# EAGLE design Honey_v2_a (EAGLE 7.2.0)

## Sheet 1 of 2
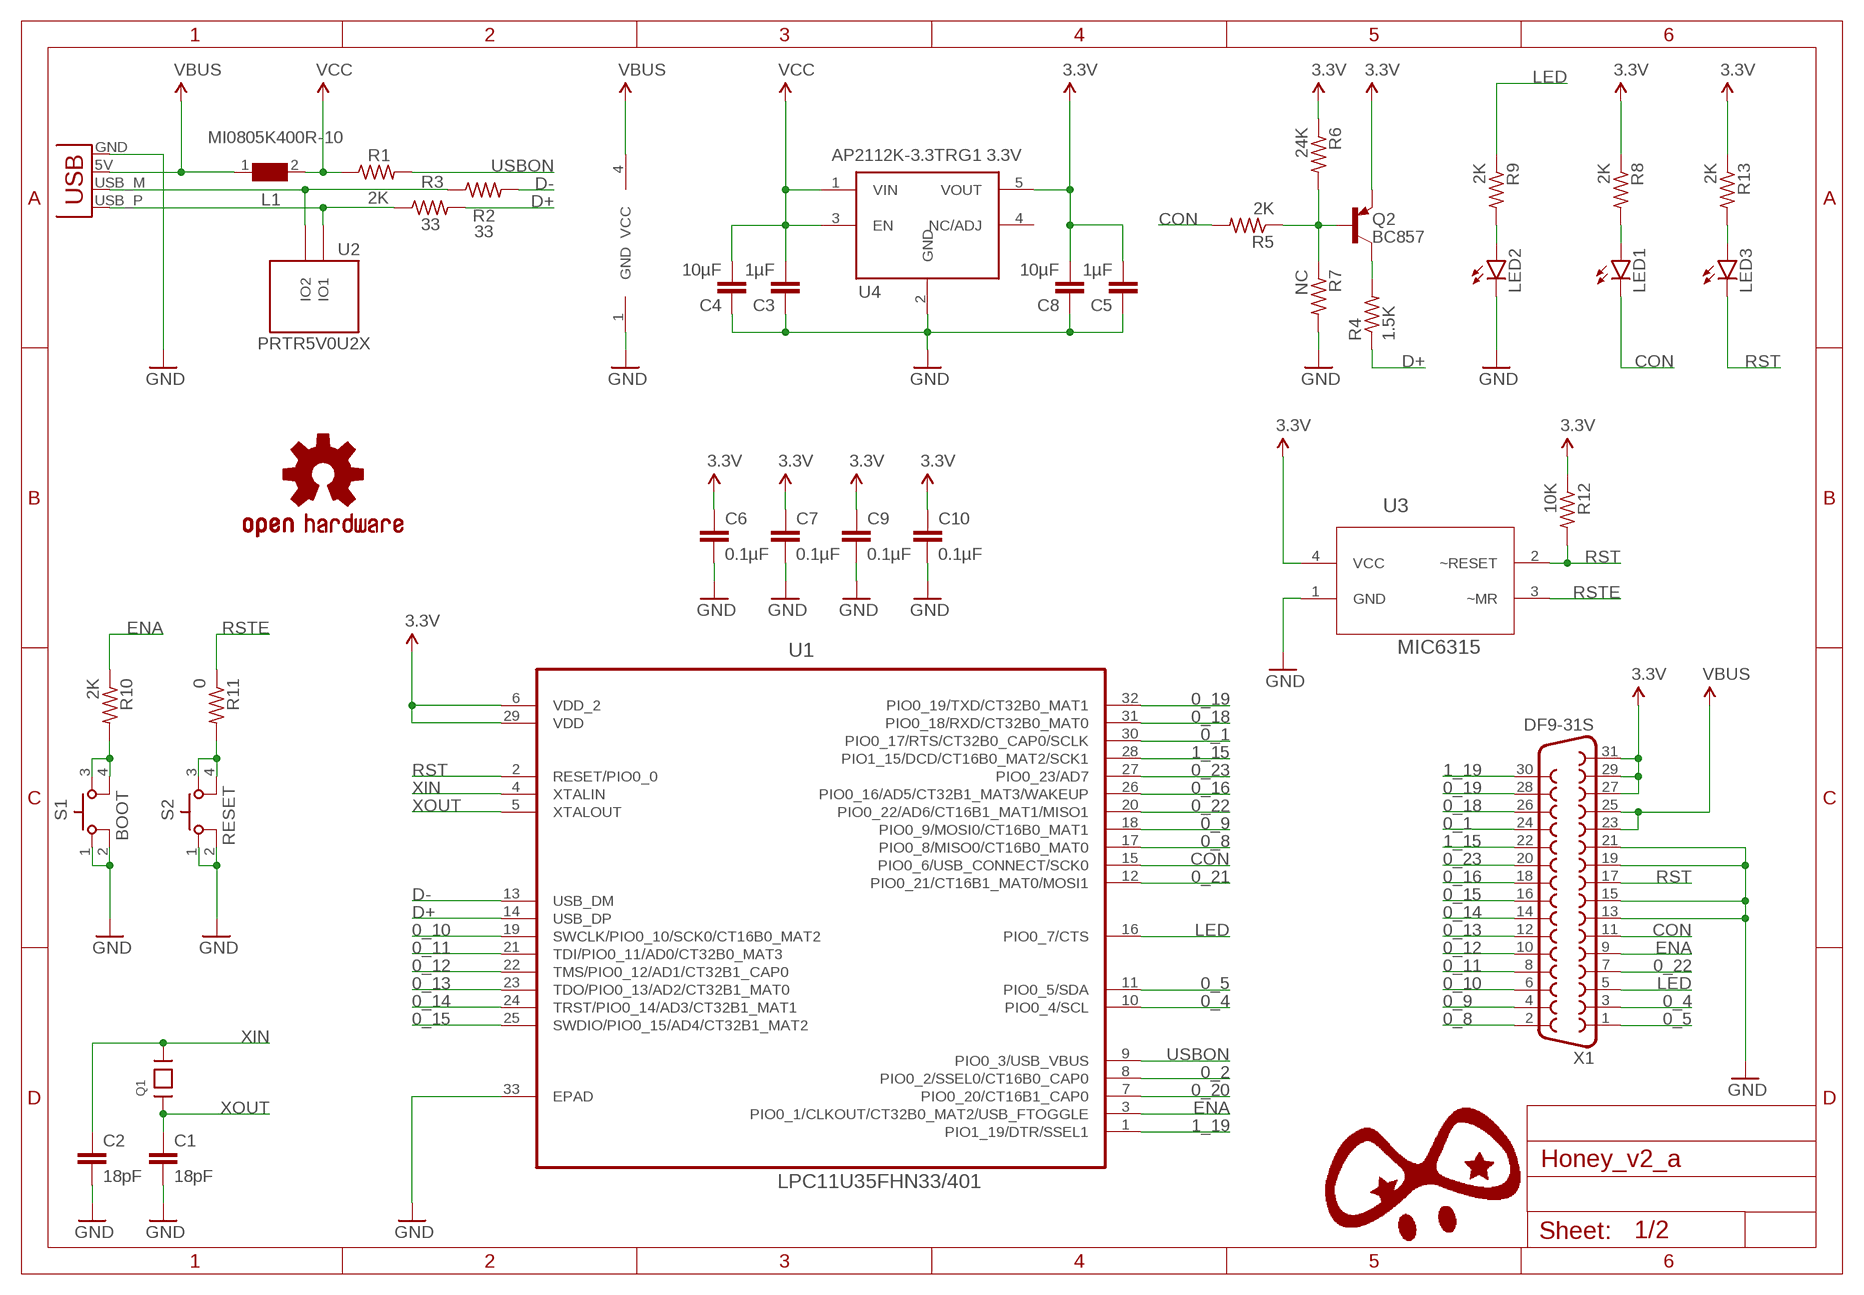
[diagram p0: schematic, sheet 1]

### Parts
C1  18pF  C-EUC0402  [C0402]
C2  18pF  C-EUC0402  [C0402]
C3  1µF  CAP0603-CAP  [0603-CAP]
C4  10µF  CAP0603-CAP  [0603-CAP]
C5  1µF  CAP0603-CAP  [0603-CAP]
C6  0.1µF  C-EUC0402  [C0402]
C7  0.1µF  C-EUC0402  [C0402]
C8  10µF  CAP0603-CAP  [0603-CAP]
C9  0.1µF  C-EUC0402  [C0402]
C10  0.1µF  C-EUC0402  [C0402]
J1  USBPCB  [USB-A-PCB]
L1  MI0805K400R-10  FERRITE-74279201_0805  [0805]
LED1  LED0603  [LED-0603]
LED2  LED0603  [LED-0603]
LED3  LED0603  [LED-0603]
LOGO1  OSHW-LOGOS  [OSHW-LOGO-S]
Q1  12MHz 4 pad crystal 3.2x2.5  CRYSTAL3.2X2.5  [CRYSTAL_3.2X2.5]
Q2  BC857  BC857A-PNP-SOT23-BEC  [SOT23-BEC]
R1  2K  R-US_R0402  [R0402]
R2  33  R-US_R0603  [R0603]
R3  33  R-US_R0603  [R0603]
R4  1.5K  R-US_R0402  [R0402]
R5  2K  R-US_R0402  [R0402]
R6  24K  R-US_R0402  [R0402]
R7  NC  R-US_R0402  [R0402]
R8  2K  R-US_R0402  [R0402]
R9  2K  R-US_R0402  [R0402]
R10  2K  R-US_R0402  [R0402]
R11  0  R-US_R0402  [R0402]
R12  10K  R-US_R0402  [R0402]
R13  2K  R-US_R0402  [R0402]
S1  BOOT  MINI_PUSHBUTTON  [MINI_PUSHBUTTON]
S2  RESET  MINI_PUSHBUTTON  [MINI_PUSHBUTTON]
U1  LPC11U35FHN33/401  [QFN65P700X700X100-33N]
U2  PRTR5V0U2X  [SOT-143B]
U3  MIC6315  [SOT-143B]
U4  AP2112K-3.3TRG1 3.3V  5PIN_REG  [SOT23-5]
X1  DF9-31S  [DF9-31S]

### Nets
0_1: U1.30(PIO0_17/RTS/CT32B0_CAP0/SCLK) X1.24
0_2: U1.8(PIO0_2/SSEL0/CT16B0_CAP0)
0_4: U1.10(PIO0_4/SCL) X1.3
0_5: U1.11(PIO0_5/SDA) X1.1
0_8: U1.17(PIO0_8/MISO0/CT16B0_MAT0) X1.2
0_9: U1.18(PIO0_9/MOSI0/CT16B0_MAT1) X1.4
0_10: U1.19(SWCLK/PIO0_10/SCK0/CT16B0_MAT2) X1.6
0_11: U1.21(TDI/PIO0_11/AD0/CT32B0_MAT3) X1.8
0_12: U1.22(TMS/PIO0_12/AD1/CT32B1_CAP0) X1.10
0_13: U1.23(TDO/PIO0_13/AD2/CT32B1_MAT0) X1.12
0_14: U1.24(TRST/PIO0_14/AD3/CT32B1_MAT1) X1.14
0_15: U1.25(SWDIO/PIO0_15/AD4/CT32B1_MAT2) X1.16
0_16: U1.26(PIO0_16/AD5/CT32B1_MAT3/WAKEUP) X1.18
0_18: U1.31(PIO0_18/RXD/CT32B0_MAT0) X1.26
0_19: U1.32(PIO0_19/TXD/CT32B0_MAT1) X1.28
0_20: U1.7(PIO0_20/CT16B1_CAP0)
0_21: U1.12(PIO0_21/CT16B1_MAT0/MOSI1)
0_22: U1.20(PIO0_22/AD6/CT16B1_MAT1/MISO1) X1.7
0_23: U1.27(PIO0_23/AD7) X1.20
1_15: U1.28(PIO1_15/DCD/CT16B0_MAT2/SCK1) X1.22
1_19: U1.1(PIO1_19/DTR/SSEL1) X1.30
3.3V: C5.2 C6.1 C7.1 C8.2 C9.1 C10.1 Q2.E R6.1 R8.1 R12.1 R13.1 U1.6(VDD_2) U1.29(VDD) U3.4(VCC) U4.5(VOUT) X1.27 X1.29 X1.31 ; also sheet 2
AD+: J1.USB_P(D+) R3.1 U2.2(IO1)
AD-: J1.USB_M(D-) R2.1 U2.3(IO2)
CON: LED1.C R5.2 U1.15(PIO0_6/USB_CONNECT/SCK0) X1.11
D+: R3.2 R4.1 U1.14(USB_DP)
D-: R2.2 U1.13(USB_DM)
ENA: R10.1 U1.3(PIO0_1/CLKOUT/CT32B0_MAT2/USB_FTOGGLE) X1.9
GND: C1.2 C2.2 C3.1 C4.1 C5.1 C6.2 C7.2 C8.1 C9.2 C10.2 J1.GND LED2.C R7.2 S1.1 S1.2 S2.1 S2.2 U1.33(EPAD) U2.1(GND) U3.1(GND) U4.2(GND) X1.13 X1.15 X1.19 X1.21 ; also sheet 2
LED: R9.1 U1.16(PIO0_7/CTS) X1.5
N$1: Q2.C R4.2
N$2: Q2.B R5.1 R6.2 R7.1
N$12: LED2.A R9.2
N$14: R10.2 S1.3 S1.4
N$20: R11.2 S2.3 S2.4
N$22: LED1.A R8.2
N$23: LED3.A R13.2
RST: LED3.C R12.2 U1.2(RESET/PIO0_0) U3.2(~RESET) X1.17
RSTE: R11.1 U3.3(~MR)
USBON: R1.2 U1.9(PIO0_3/USB_VBUS)
VBUS: J1.5V(VBUS) L1.1 U2.4(VCC) X1.23 X1.25 ; also sheet 2
VCC: C3.2 C4.2 L1.2 R1.1 U4.1(VIN) U4.3(EN)
XIN: C2.1 Q1.3 U1.4(XTALIN)
XOUT: C1.1 Q1.1 U1.5(XTALOUT)
Unconnected: U4.4(NC/ADJ)

## Sheet 2 of 2
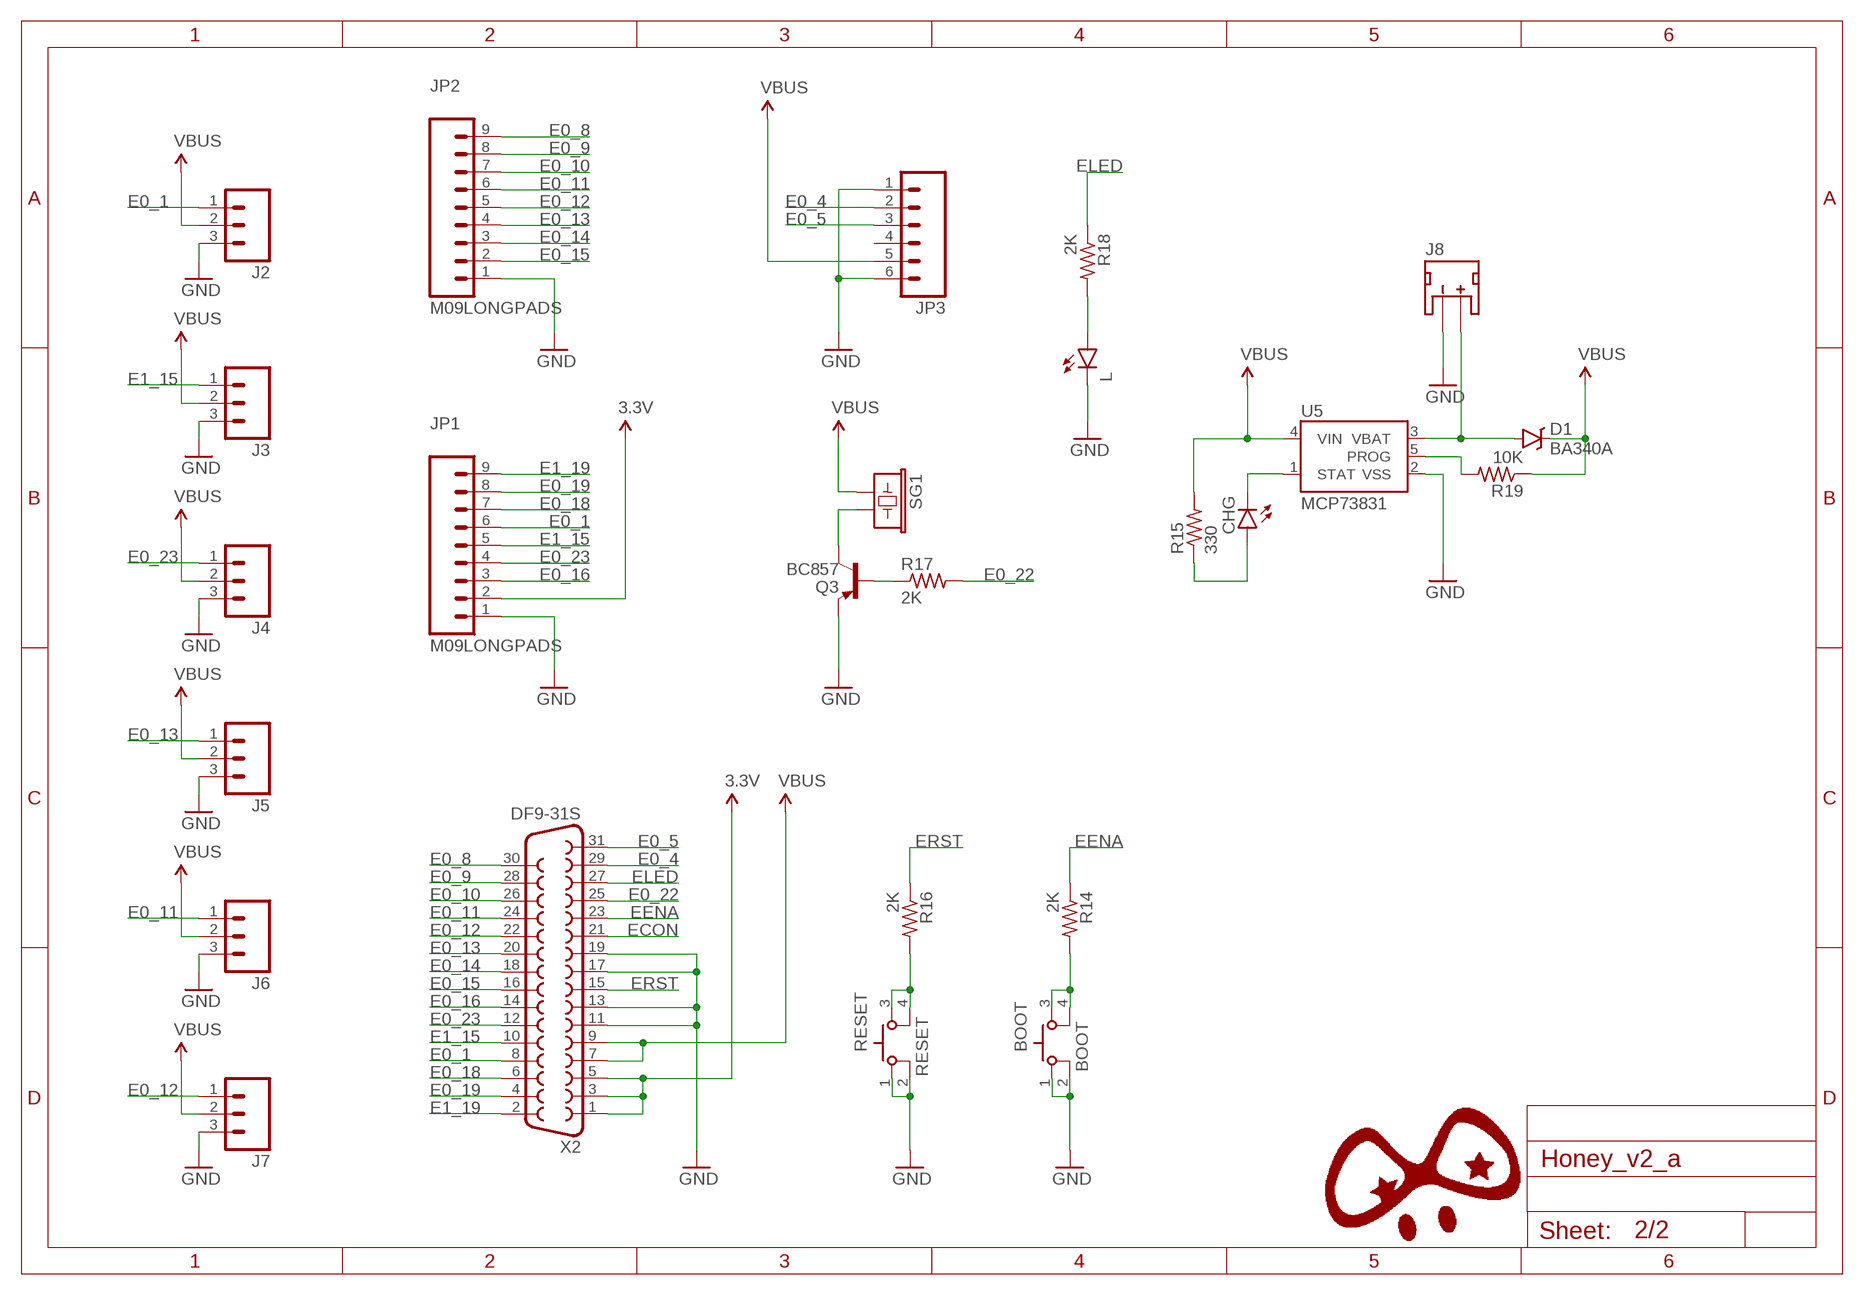
[diagram p1: schematic, sheet 2]

### Parts
BOOT  BOOT  MINI_PUSHBUTTON  [MINI_PUSHBUTTON]
CHG  LED0603  [LED-0603]
D1  BA340A  B340A  [SMA-DIODE]
J2  M03LOCK_NO_SILK  [1X03_LOCK_NO_SILK]
J3  M03LOCK_NO_SILK  [1X03_LOCK_NO_SILK]
J4  M03LOCK_NO_SILK  [1X03_LOCK_NO_SILK]
J5  M03LOCK_NO_SILK  [1X03_LOCK_NO_SILK]
J6  M03LOCK_NO_SILK  [1X03_LOCK_NO_SILK]
J7  M03LOCK_NO_SILK  [1X03_LOCK_NO_SILK]
J8  JST_2MM_MALE  [JST-2-SMD]
JP1  M09LONGPADS  [1X09_LONGPADS]
JP2  M09LONGPADS  [1X09_LONGPADS]
JP3  M06LONGPADS  [1X06_LONGPADS]
L  LED0603  [LED-0603]
Q3  BC857  BC857A-PNP-SOT23-BEC  [SOT23-BEC]
R14  2K  R-US_R0402  [R0402]
R15  330  R-US_R0402  [R0402]
R16  2K  R-US_R0402  [R0402]
R17  2K  R-US_R0402  [R0402]
R18  2K  R-US_R0402  [R0402]
R19  10K  R-US_R0402  [R0402]
RESET  RESET  MINI_PUSHBUTTON  [MINI_PUSHBUTTON]
SG1  BUZZERSMD2  [BUZZER-CCV]
U5  MCP73831  [SOT23-5]
X2  DF9-31S  [DF9-31S]

### Nets
3.3V: JP1.2 X2.1 X2.3 X2.5 ; also sheet 1
E0_1: J2.1 JP1.6 X2.8
E0_4: JP3.2 X2.29
E0_5: JP3.3 X2.31
E0_8: JP2.9 X2.30
E0_9: JP2.8 X2.28
E0_10: JP2.7 X2.26
E0_11: J6.1 JP2.6 X2.24
E0_12: J7.1 JP2.5 X2.22
E0_13: J5.1 JP2.4 X2.20
E0_14: JP2.3 X2.18
E0_15: JP2.2 X2.16
E0_16: JP1.3 X2.14
E0_18: JP1.7 X2.6
E0_19: JP1.8 X2.4
E0_22: R17.2 X2.25
E0_23: J4.1 JP1.4 X2.12
E1_15: J3.1 JP1.5 X2.10
E1_19: JP1.9 X2.2
ECON: X2.21
EENA: R14.1 X2.23
ELED: R18.1 X2.27
ERST: R16.1 X2.15
GND: BOOT.1 BOOT.2 J2.3 J3.3 J4.3 J5.3 J6.3 J7.3 J8.1(-) JP1.1 JP2.1 JP3.1 JP3.6 L.C Q3.E RESET.1 RESET.2 U5.2(VSS) X2.11 X2.13 X2.17 X2.19 ; also sheet 1
N$3: Q3.C SG1.-
N$4: L.A R18.2
N$5: BOOT.3 BOOT.4 R14.2
N$6: R16.2 RESET.3 RESET.4
N$7: Q3.B R17.1
N$8: CHG.C U5.1(STAT)
N$9: CHG.A R15.1
N$10: R19.2 U5.5(PROG)
N$11: D1.A J8.2(+) U5.3(VBAT)
VBUS: D1.C J2.2 J3.2 J4.2 J5.2 J6.2 J7.2 JP3.5 R15.2 R19.1 SG1.+ U5.4(VIN) X2.7 X2.9 ; also sheet 1
Unconnected: J8.NC1(PAD1) J8.NC2(PAD2) JP3.4

## Library data of the parts
BOOT RESET S1 S2 = GHI2:MINI_PUSHBUTTON
C1 C2 C6 C7 C9 C10 = resistor:C-EU: CAPACITOR, European symbol
C3-C5 C8 = SparkFun-Passives:CAP: Capacitor Standard 0603 ceramic capacitor, and 0.1" leaded capacitor.
CHG L LED1-LED3 = SparkFun-LED:LED: LEDs Standard schematic elements and footprints for 5mm, 3mm, 1206, and 0603 sized LEDs. 5mm - Spark Fun Electronics SKU : COM-00529 (and others)
D1 = SparkFun-DiscreteSemi:B340A: Schottky Diode 3A-40V; PROD_ID: DIO-09886
J1 = SparkFun-Connectors:USB: USB Connectors USB-B-PTH is fully proven SKU : PRT-00139/CONN-08278 USB-miniB is fully proven SKU : PRT-00587 USB-A-PCB is untested. USB-A-H is throughly reviewed, but untested. Spark Fun Electronics SKU : PRT-00437 USB-B-SMT is throughly reviewed, but untested. Needs silkscreen touching up. USB-A-S has not been used/tested USB-MB-H has not been used/tested USB-MICROB has been used. CONN-09505
J2-J7 = SparkFun-Connectors:M03: Header 3 Standard 3-pin 0.1" header. Use with straight break away headers (SKU : PRT-00116), right angle break away headers (PRT-00553), swiss pins (PRT-00743), machine pins (PRT-00117), and female headers (PRT-00115). Molex polarized connector foot print use with SKU : PRT-08232 with associated crimp pins and housings.
J8 = SparkFun-Connectors:JST_2MM_MALE: Mates to single-cell LiPo batteries. CONN-08352; PROD_ID: CONN-08352
JP1 JP2 = SparkFun-Connectors:M09: Header 9 Standard 9-pin 0.1" header. Use with straight break away headers (SKU : PRT-00116), right angle break away headers (PRT-00553), swiss pins (PRT-00743), machine pins (PRT-00117), and female headers (PRT-00115).
JP3 = SparkFun-Connectors:M06: Header 6 Standard 6-pin 0.1" header. Use with straight break away headers (SKU : PRT-00116), right angle break away headers (PRT-00553), swiss pins (PRT-00743), machine pins (PRT-00117), and female headers (PRT-00115). Molex polarized connector foot print use with SKU : PRT-08094 with associated crimp pins and housings. NOTES ON THE VARIANTS LOCK and LOCK_LONGPADS... This footprint was designed to help hold the alignment of a through-hole component (i.e. 6-pin header) while soldering it into place. You may notice that each hole has been shifted either up or down by 0.005 of an inch from it's more standard position (which is a perfectly straight line). This slight alteration caused the pins (the squares in the middle) to touch the edges of the holes. Because they are alternating, it causes a "brace" to hold the component in place. 0.005 has proven to be the perfect amount of "off-center" position when using our standard breakaway headers. Although looks a little odd when you look at the bare footprint, once you have a header in there, the alteration is very hard to notice. Also,if you push a header all the way into place, it is covered up entirely on the bottom side. This idea of altering the position of holes to aid alignment will be further integrated into the Sparkfun Library for other footprints. It can help hold any component with 3 or more connection pins.
L1 = Honey_v2:FERRITE: SMD EMI Suppression Ferrite Beads; MPN: 74279201; OC_FARNELL: 1635708; OC_NEWARK: 08P2359; PACKAGE: IND-0805; SUPPLIER: Wuerth Elektronik
LOGO1 = SparkFun-Aesthetics:OSHW-LOGO: Open Source Hardware Logo This logo indicates the piece of hardware it is found on incorporates a OSHW license and/or adheres to the definition of open source hardware found here: http://freedomdefined.org/OSHW
Q1 = GHI:CRYSTAL3.2X2.5
Q2 Q3 = transistor:*-PNP-: PNP Transistror
R1-R19 = resistor:R-US_: RESISTOR, American symbol
SG1 = SparkFun-Electromechanical:BUZZER: Buzzer 12mm Spark Fun Electronics SKU : Comp-Buzzer
U1 = Honey_v2:LPC11U35FHN33/401: MCU, 32BIT, ARM CORTEX-M0, 32HVQFN; MPN: LPC11U35FHN33/401; OC_FARNELL: 2115659; OC_NEWARK: 24W5343; PACKAGE: HVQFN33; SUPPLIER: NXP
U2 = Honey_v2:PRTR5V0U2X?: I2C-Bus EDS Protection Ulta low capacitance double rail-to-rail ESD protection diode Documentation Datasheet <http://www.nxp.com/documents/data_sheet/PRTR5V0U2X.pdf> General Description Ultra low capacitance rail-to-rail ElectroStatic Discharge (ESD) protection diode in a small SOT143B Surface-Mounted Device (SMD) plastic package designed to protect two Hi-Speed data lines or high-frequency signal lines from the damage caused by ESD and other transients. PRTR5V0U2X incorporates two pairs of ultra low capacitance rail-to-rail diodes as well as an additional ESD protection diode to ensure signal line protection even if no supply voltage is available. Features ESD protection of two Hi-Speed data lines or high-frequency signal lines Ultra low input/output to ground capacitance: C(I/O-GND) = 1 pF ESD protection up to 8kV IEC 61000-4-2, level 4 (ESD) Very low clamping voltage due to an integrated additional ESD protection diode Very low reverse current Small SMD plastic package Applications USB 2.0 ports Digital Video Interface (DVI)/High Definition Multimedia Interface (HDMI) interfaces Mobile and cordless phones Personal Digital Assistants (PDA) Digital Cameras Wide Area Network (WAN) / Local Area Network (LAN) systems PCs, notebooks, printers, and other PC peripherals; APPLICATIONS: General Purpose; BIDIRECTIONAL_CHANNELS: 2; CAPACITANCE: 1pF @ 1MHz; CURRENT_PEAK_PULSE: -; DESCRIPTION: TVS DIODE 5.5VWM SOT143B; DOCUMENTATION_LINK: <a href="http://www.nxp.com/documents/data_sheet/PRTR5V0U2X.pdf">Datasheet</a>; DOCUMENTATION_URL: http://www.nxp.com/documents/data_sheet/PRTR5V0U2X.pdf; MANUFACTURER: NXP Semiconductors; MOUNTING_TYPE: Surface Mount; OPERATING_TEMPERATURE: -40C ~ 85C; PART_NUMBER: PRTR5V0U2X,215; POWER-PEAK_PULSE: -; POWER_LINE_PROTECTION: Yes; SUPPLIER_ITEM_LINK: <a href="http://www.digikey.com/product-detail/en/PRTR5V0U2X,215/568-4140-1-ND/1589981">Details</a>; SUPPLIER_ITEM_NUMBER: 568-4140-1-ND; SUPPLIER_ITEM_URL: http://www.digikey.com/product-detail/en/PRTR5V0U2X,215/568-4140-1-ND/1589981; SUPPLIER_LINK: <a href="http://www.digikey.com">Home Page</a>; SUPPLIER_NAME: Digi-Key; SUPPLIER_URL: http://www.digikey.com; TYPE: Steering (Rail to Rail); UNIDIRECTIONAL_CHANNELS: -; VOLTAGE_BREAKDOWN: 6V; VOLTAGE_CLAMPING: -; VOLTAGE_REVERSE: 5.5V
U3 = Honey_v2:MIC6315: MIC6315
U4 = GHI:5PIN_REG
U5 = SparkFun-PowerIC:MCP73831: Miniature single cell, fully integrated Li-Ion, Li-polymer charge management controller http://ww1.microchip.com/downloads/en/DeviceDoc/21984a.pdf IC-09995; PROD_ID: IC-09995
X1 X2 = con-hirose:DF9-31S: SMD CONNECTOR Source: con-hirose.lbr from Bob Starr <rtzaudio@mindspring.com>; MPN: DF9-31S-1V(32); OC_FARNELL: 1798382; OC_NEWARK: 74R3383

## Net classes
0 default: width 0.254 mm, drill 0.254 mm, clearance 0.203 mm

## Board
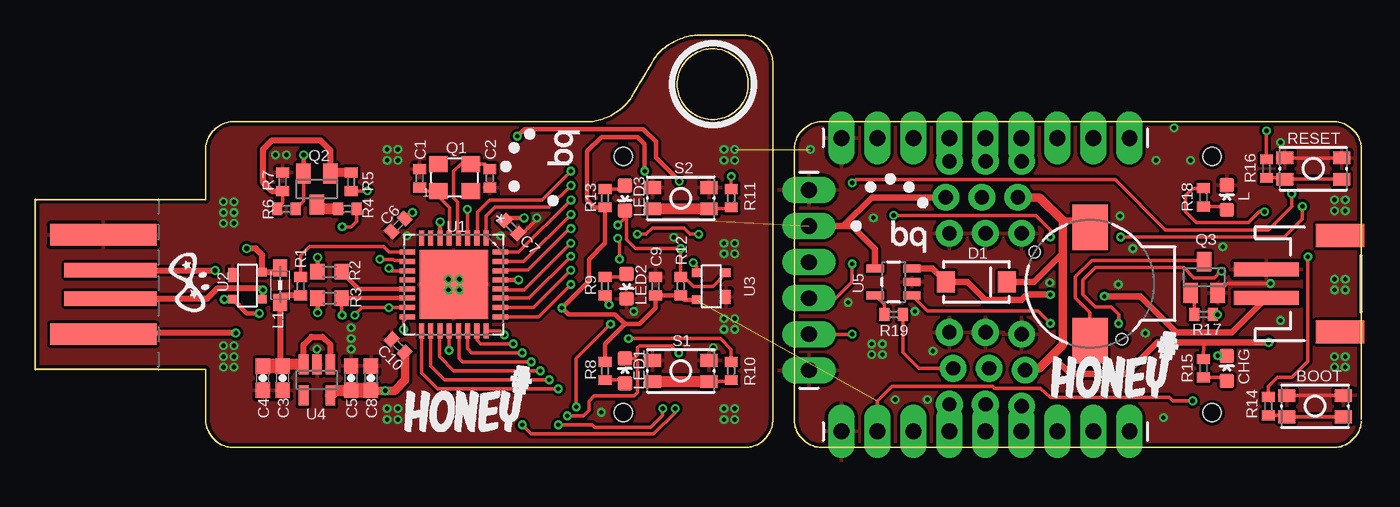
[diagram p2: board, top side]
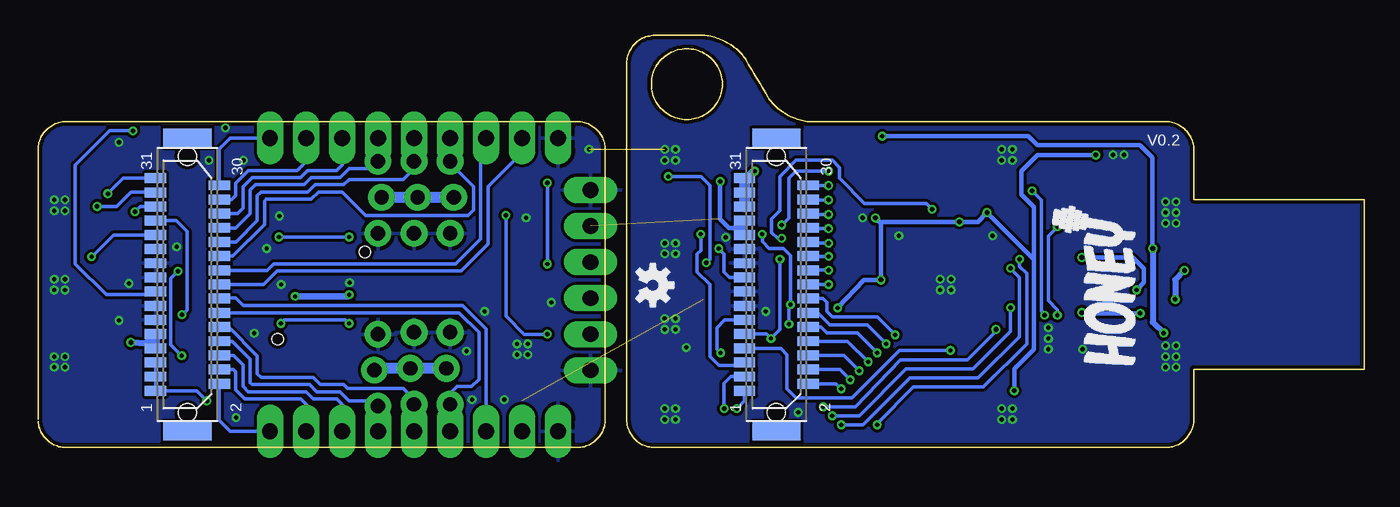
[diagram p3: board, bottom side, seen from below]

Size 93.51 x 29.08 mm. Coordinates in mm from the lower left corner, seen from the top.
Outline: 93.51,1.86 93.49,1.73 93.46,1.6 93.44,1.47 93.4,1.34 93.35,1.22 93.3,1.1 93.23,0.99 93.16,0.88 93.09,0.78 93.01,0.68 92.83,0.5 92.73,0.41 92.62,0.34 92.52,0.27 92.4,0.21 92.16,0.11 92.04,0.07 91.91,0.04 91.78,0.01 91.64,0 55.37,0 55.23,0.01 55.1,0.04 54.97,0.07 54.85,0.11 54.61,0.21 54.5,0.27 54.39,0.34 54.28,0.41 54.18,0.5 54,0.68 53.92,0.78 53.85,0.88 53.78,0.99 53.71,1.1 53.61,1.34 53.57,1.47 53.55,1.6 53.52,1.73 53.51,1.86 53.51,21.14 53.52,21.27 53.55,21.4 53.57,21.53 53.61,21.66 53.66,21.78 53.71,21.9 53.78,22.01 53.85,22.12 53.92,22.22 54,22.32 54.18,22.5 54.28,22.59 54.39,22.66 54.5,22.73 54.61,22.79 54.73,22.84 54.85,22.89 54.97,22.93 55.1,22.96 55.23,22.99 55.37,23 91.64,23 91.78,22.99 91.91,22.96 92.04,22.93 92.16,22.89 92.28,22.84 92.4,22.79 92.52,22.73 92.62,22.66 92.73,22.59 92.83,22.5 93.01,22.32 93.09,22.22 93.23,22.01 93.3,21.9 93.35,21.78 93.4,21.66 93.44,21.53 93.46,21.4 93.49,21.27 93.51,21.14 93.51,2
Outline: 50.26,25.47 50.24,25.3 50.2,25.14 50.17,24.98 50.12,24.82 50.06,24.67 50,24.52 49.92,24.38 49.83,24.24 49.74,24.11 49.64,23.99 49.41,23.76 49.29,23.66 49.02,23.48 48.88,23.4 48.73,23.34 48.58,23.27 48.42,23.23 48.26,23.19 48.1,23.16 47.93,23.14 47.58,23.14 47.41,23.16 47.25,23.19 47.09,23.23 46.93,23.27 46.78,23.34 46.63,23.4 46.49,23.48 46.36,23.57 46.22,23.66 46.1,23.76 45.87,23.99 45.77,24.11 45.68,24.24 45.59,24.38 45.52,24.52 45.45,24.67 45.39,24.82 45.34,24.98 45.31,25.14 45.27,25.3 45.26,25.47 45.26,25.81 45.27,25.98 45.31,26.15 45.34,26.31 45.39,26.47 45.45,26.61 45.52,26.76 45.59,26.91 45.77,27.17 45.87,27.3 45.99,27.41 46.1,27.52 46.22,27.62 46.36,27.71 46.49,27.8 46.63,27.88 46.78,27.95 46.93,28.01 47.09,28.06 47.25,28.09 47.41,28.12 47.58,28.14 47.93,28.14 48.1,28.12 48.42,28.06 48.58,28.01 48.73,27.95 48.88,27.88 49.02,27.8 49.29,27.62 49.41,27.52 49.52,27.41 49.64,27.3 49.74,27.17 49.92,26.91 50,26.76 50.06,26.61 50.12,26.47 50.17,26.31 50.24,25.98 50.26,25.81 50.26,25.47
Outline: 50.14,29.08 46.48,29.08 46.34,29.07 46.2,29.04 46.05,29.02 45.91,28.99 45.76,28.94 45.62,28.9 45.47,28.85 45.19,28.72 45.04,28.65 44.91,28.57 44.77,28.5 44.64,28.41 44.51,28.32 44.38,28.23 44.26,28.13 44.15,28.03 44.04,27.93 43.94,27.82 43.84,27.71 43.75,27.59 43.67,27.48 43.6,27.36 43.4,27.03 43.2,26.7 43,26.37 42.81,26.04 42.61,25.71 42.41,25.38 42.21,25.05 42.02,24.72 41.95,24.6 41.86,24.48 41.68,24.26 41.57,24.15 41.35,23.95 41.23,23.85 41.1,23.76 40.98,23.67 40.84,23.58 40.71,23.5 40.57,23.43 40.43,23.36 40.14,23.23 40,23.18 39.85,23.14 39.7,23.09 39.56,23.06 39.27,23.01 39.13,23 13.86,23 13.73,22.99 13.6,22.96 13.47,22.93 13.34,22.89 13.1,22.79 12.99,22.73 12.88,22.66 12.78,22.59 12.68,22.5 12.59,22.41 12.5,22.32 12.41,22.22 12.34,22.12 12.27,22.01 12.21,21.9 12.11,21.66 12.07,21.53 12.04,21.4 12.01,21.27 12,21.14 12,17.5 0,17.5 0,5.5 12,5.5 12,1.86 12.01,1.73 12.04,1.6 12.07,1.47 12.11,1.34 12.21,1.1 12.27,0.99 12.34,0.88 12.41,0.78 12.5,0.68 12.59,0.59 12.68,0.5 12.78,0.41 12.88,0.34 12.99,0.27 13.1,0.21 13.22,0.16 13.34,0.11 13.47,0.07 13.6,0.04 13.73,0.01 13.86,0 50.14,0 50.27,0.01 50.4,0.04 50.53,0.07 50.66,0.11 50.78,0.16 50.9,0.21 51.01,0.27 51.12,0.34 51.22,0.41 51.32,0.5 51.41,0.59 51.5,0.68 51.59,0.78 51.66,0.88 51.73,0.99 51.79,1.1 51.84,1.22 51.89,1.34 51.93,1.47 51.96,1.6 51.99,1.73 52,1.86 52,27.22 51.99,27.35 51.96,27.48 51.93,27.61 51.89,27.74 51.84,27.85 51.79,27.97 51.73,28.09 51.66,28.19 51.59,28.3 51.5,28.4 51.41,28.49 51.32,28.58 51.22,28.66 51.12,28.74 51.01,28.81 50.9,28.87 50.78,28.92 50.66,28.97 50.53,29.01 50.4,29.04 50.27,29.06 50.14,29.08
Copper layers (1*16): Top 0.035mm / dielectric 1.5mm / Bottom 0.035mm
Design rules "pighixxx_CAM_DRC_V1.0": minimum track width 6mil, minimum drill 12mil, track to track 6mil, track to pad 6mil, pad to pad 6mil, via to via 6mil, smd to smd 0mil, copper to edge 10mil, drill to drill 10mil, minimum pad ring 10mil, minimum via ring 6mil, stop-mask expansion 2mil, vias tented up to drill 100mil, thermal gap 10mil

### Footprints (pad centres in the part's own frame; a part is rotated, then mirrored left to right if it is on the bottom)
MINI_PUSHBUTTON = smd 1.2 x 0.9: 1 -2,0.75; 2 2,0.75; 3 -2,-0.75; 4 2,-0.75
C0402 = smd 0.7 x 0.9: 1 -0.65,0; 2 0.65,0
0603-CAP = smd 1.1 x 1: 1 -0.85,0; 2 0.85,0
LED-0603 = smd 1 x 1: A 0,-0.877; C 0,0.877
SMA-DIODE = smd 1.27 x 1.47: A -2.15,0; C 2.15,0
USB-A-PCB = smd 7.5 x 1.5: 5V -0.2,-3.5; GND -0.2,3.5 | smd 6.5 x 1: USB_M 0.3,-1; USB_P 0.3,1
1X03_LOCK_NO_SILK = drill 1.016 pad 1.88: 1 0,0.127; 2 2.54,-0.127; 3 5.08,0.127
JST-2-SMD = smd 1 x 4.6: 1 -1,-3.7; 2 1,-3.7 | smd 1.6 x 3.4: NC1 -3.4,1.5; NC2 3.4,1.5
1X09_LONGPADS = drill 1.118 pad 1.88 long: 1 0,0; 2 2.54,0; 3 5.08,0; 4 7.62,0; 5 10.16,0; 6 12.7,0; 7 15.24,0; 8 17.78,0; 9 20.32,0
1X06_LONGPADS = drill 1.118 pad 1.88 long: 1 0,0; 2 2.54,0; 3 5.08,0; 4 7.62,0; 5 10.16,0; 6 12.7,0
0805 = smd 1.2 x 1: 1 -1.2,0; 2 1.2,0
CRYSTAL_3.2X2.5 = smd 1.3 x 1.1: 1 -1.1,-0.9; 2 1.2,-0.9; 3 1.2,1; 4 -1.1,1
SOT23-BEC = smd 1 x 1.4: B -0.95,-1.1; C 0,1.1; E 0.95,-1.1
R0402 = smd 0.7 x 0.9: 1 -0.65,0; 2 0.65,0
R0603 = smd 1 x 1.1: 1 -0.85,0; 2 0.85,0
BUZZER-CCV = smd 3.2 x 2.5: + 4,0; - -4,0 | hole 0.8: -3.9,-2.25; 2.25,3.9
QFN65P700X700X100-33N = smd 1.067 x 0.356: 1 -3.277,2.286; 2 -3.277,1.626; 3 -3.277,0.965; 4 -3.277,0.33; 5 -3.277,-0.33; 6 -3.277,-0.965; 7 -3.277,-1.626; 8 -3.277,-2.286; 17 3.277,-2.286; 18 3.277,-1.626; 19 3.277,-0.965; 20 3.277,-0.33; 21 3.277,0.33; 22 3.277,0.965; 23 3.277,1.626; 24 3.277,2.286 | smd 0.356 x 1.067: 9 -2.286,-3.277; 10 -1.626,-3.277; 11 -0.965,-3.277; 12 -0.33,-3.277; 13 0.33,-3.277; 14 0.965,-3.277; 15 1.626,-3.277; 16 2.286,-3.277; 25 2.286,3.277; 26 1.626,3.277; 27 0.965,3.277; 28 0.33,3.277; 29 -0.33,3.277; 30 -0.965,3.277; 31 -1.626,3.277; 32 -2.286,3.277 | smd 4.851 x 4.851: 33 0,0
SOT-143B = smd 1 x 0.6: 1 -0.75,-1.05 | smd 0.6 x 0.6: 2 0.95,-1.05; 3 0.95,1.05; 4 -0.95,1.05
SOT23-5 = smd 0.7 x 1.4: 1 0.95,1.1; 2 0,1.1; 3 -0.95,1.1; 4 -0.95,-1.1; 5 0.95,-1.1
SOT23-5' = smd 0.55 x 1.2: 1 -0.95,-1.3; 2 0,-1.3; 3 0.95,-1.3; 4 0.95,1.3; 5 -0.95,1.3
DF9-31S = smd 0.7 x 1.5: 1 -7.5,2.25; 2 -7,-2.25; 3 -6.5,2.25; 4 -6,-2.25; 5 -5.5,2.25; 6 -5,-2.25; 7 -4.5,2.25; 8 -4,-2.25; 9 -3.5,2.25; 10 -3,-2.25; 11 -2.5,2.25; 12 -2,-2.25; 13 -1.5,2.25; 14 -1,-2.25; 15 -0.5,2.25; 16 0,-2.25; 17 0.5,2.25; 18 1,-2.25; 19 1.5,2.25; 20 2,-2.25; 21 2.5,2.25; 22 3,-2.25; 23 3.5,2.25; 24 4,-2.25; 25 4.5,2.25; 26 5,-2.25; 27 5.5,2.25; 28 6,-2.25; 29 6.5,2.25; 30 7,-2.25; 31 7.5,2.25 | smd 1.3 x 3.4: M1 -10.35,0; M2 10.35,0 | hole 1.27: 9.05,0; -9.05,0

### Placement (x,y rotation side)
BOOT  90.23,2.92 0 top
C1  27.09,19 90 top
C2  32.04,19 270 top
C3  17.43,4.9 90 top
C4  16.04,4.9 90 top
C5  22.26,4.9 270 top
C6  25.56,15.7 225 top
C7  33.56,15.57 315 top
C8  23.66,4.9 270 top
C9  43.72,11.38 90 top
C10  25.56,7.19 135 top
CHG  84.01,5.59 0 top
D1  66.35,11.68 0 top
J1  4.99,11.5 0 top
J2  69.66,2.92 90 top
J3  67.12,3.05 90 top
J4  64.58,3.05 90 top
J5  64.32,20.19 270 top
J6  69.4,20.19 270 top
J7  66.86,20.19 270 top
J8  90.48,11.56 270 top
JP1  56.83,1.14 0 top
JP2  56.83,21.84 0 top
JP3  54.54,5.46 90 top
L  84.01,17.65 0 top
L1  17.26,11.45 270 top
LED1  41.56,5.41 0 top
LED2  41.69,11.38 180 top
LED3  41.56,17.6 180 top
LOGO1  50.15,11.45 270 bottom
Q1  29.5,19 0 top
Q2  19.85,18.24 180 top
Q3  82.41,12.01 0 top
R1  18.7,11.38 90 top
R2  20.74,12.39 0 top
R3  20.74,10.54 0 top
R4  22.01,16.84 180 top
R5  22.26,18.74 270 top
R6  17.69,16.84 180 top
R7  17.43,18.74 90 top
R8  40.17,5.41 270 top
R9  40.17,11.38 90 top
R10  49.06,5.41 270 top
R11  49.06,17.6 270 top
R12  45.5,11.38 90 top
R13  40.17,17.6 90 top
R14  86.93,2.92 270 top
R15  82.36,5.59 90 top
R16  86.8,19.68 270 top
R17  82.36,9.4 0 top
R18  82.36,17.65 270 top
R19  60.51,9.4 180 top
RESET  90.1,19.68 0 top
S1  45.5,5.41 0 top
S2  45.5,17.6 0 top
SG1  74.36,11.56 90 top
U1  29.5,11.5 270 top
U2  14.94,11.43 270 top
U3  47.66,11.38 90 top
U4  19.85,4.77 0 top
U5  MCP73831  [SOT23-5']  60.51,11.68 90 top
U$3  [BQ_LOGO_SMALL]  38.39,17.04 90 top
U$4  [PIGHIXXX_LOGO]  12.25,9.57 90 top
U$5  [LOGO_MEDIUM]  26.04,1.09 0 top
U$6  [LOGO_BIG]  16.11,5.84 90 bottom
U$19  [LOGO_MEDIUM]  71.64,3.5 0 top
U$20  [BQ_LOGO_SMALL]  57.49,13.74 0 top
X1  41.44,11.5 90 bottom
X2  82.97,11.5 90 bottom

### Tracks (layer width: path | path; a pad name or v marks a point on that pad's centre or on a via)
0_1  (via drill 0.33)
  Top 0.254: U1.30 arc-90 32.83,12.52 34.73,12.52 37.65,15.44 v37.75,15.44
  Bottom 0.254: v37.75,15.44 39.12,15.44 X1.24
0_4  (via drill 0.3)
  Top 0.254: U1.10 26.17,13.18 25.33,13.18 25.23,13.28 v24.29,13.28 | v34.33,1.6 34.96,0.96 43.6,0.96 45.12,2.49 v45.12,2.74
  Bottom 0.254: v24.29,13.28 24.29,12.77 23.78,12.27 23.78,7.31 26.83,4.27 31.79,4.27 34.33,1.73 v34.33,1.6 | X1.3 44.64,5 45.12,4.52 v45.12,2.74
0_5  (via drill 0.3)
  Top 0.254: U1.11 25.1,12.47 v24.93,12.65 | v36.87,1.6 39.25,1.6 39.43,1.42 43.37,1.42 44.23,2.28 v44.23,2.74
  Bottom 0.254: v24.93,12.65 24.29,12.01 24.29,7.82 27.21,4.9 32.04,4.9 35.34,1.6 v36.87,1.6 | v44.23,2.74 43.69,3.29 X1.1
0_8  (via drill 0.3)
  Top 0.254: U1.17 27.21,5.28 28.36,4.14 v36.87,4.14
  Bottom 0.254: X1.2 37.23,4.5 v36.87,4.14
0_9  (via drill 0.3)
  Top 0.254: U1.18 27.87,5.76 28.86,4.77 v36.23,4.77
  Bottom 0.254: X1.4 36.96,5.5 v36.23,4.77
0_10  (via drill 0.3)
  Top 0.254: v35.6,5.41 29.5,5.41 28.48,6.42 28.48,8.23 U1.19
  Bottom 0.254: X1.6 36.69,6.5 v35.6,5.41
0_11  (via drill 0.3)
  Top 0.254: v34.96,6.04 30.13,6.04 29.88,6.3 29.88,8.23 U1.21
  Bottom 0.254: X1.8 36.42,7.5 v34.96,6.04
0_12  (via drill 0.3)
  Top 0.254: U1.22 30.46,6.98 30.77,6.68 v34.33,6.68
  Bottom 0.254: v34.33,6.68 35.72,8.08 37.88,8.08 38.31,8.5 X1.10
0_13  (via drill 0.3)
  Top 0.254: U1.23 31.12,7.59 31.4,7.31 v33.69,7.31
  Bottom 0.254: v33.69,7.31 35.01,8.63 37.65,8.63 38.52,9.5 X1.12
0_14  (via drill 0.3)
  Top 0.254: U1.24 32.78,8.23 v33.06,7.95
  Bottom 0.254: v33.06,7.95 34.33,9.22 37.5,9.22 37.88,9.6 37.88,10.23 38.15,10.5 X1.14
0_15  (via drill 0.3)
  Top 0.254: U1.25 35.47,9.22 v37.75,11.5
  Bottom 0.254: v37.75,11.5 X1.16
0_16  (via drill 0.3)
  Top 0.254: U1.26 35.11,9.88 v37.75,12.52
  Bottom 0.254: v37.75,12.52 39.17,12.52 X1.18
0_18  (via drill 0.33)
  Top 0.254: U1.31 34.43,13.13 v37.75,16.46
  Bottom 0.254: v37.75,16.46 39.14,16.46 X1.26
0_19  (via drill 0.33)
  Top 0.254: U1.32 34.07,13.79 v37.75,17.47
  Bottom 0.254: v37.75,17.47 39.16,17.47 X1.28
0_22  (via drill 0.3)
  Top 0.254: U1.20 v29.17,6.86
  Bottom 0.254: X1.7 41.13,7 40.68,6.55 40.68,4.14 40.04,3.5 36.1,3.5 32.75,6.86 v29.17,6.86
0_23  (via drill 0.3)
  Top 0.254: U1.27 34.81,10.54 v37.75,13.49
  Bottom 0.254: v37.75,13.49 39.17,13.49 X1.20
1_15  (via drill 0.3)
  Top 0.254: v37.75,14.43 34.45,11.12 32.83,11.12 arc-90 U1.28
  Bottom 0.254: v37.75,14.43 39.11,14.43 X1.22
1_19  (via drill 0.33)
  Top 0.254: U1.1 31.79,16.33 32.42,16.97 36.23,16.97 v37.75,18.49
  Bottom 0.254: v37.75,18.49 39.17,18.49 X1.30
3.3V  (via drill 0.3, 0.33)  (1 unrouted)
  Top 0.254: R6.1 18.9,17.4 Q2.E | v81.59,3.3 80.2,3.3 79.94,3.55 71.56,3.55 70.85,4.19 67.62,4.19 67.5,4.32 60.39,4.32 59.37,3.3 JP1.2
  Top 0.33: U1.29 v34.07,11.83 | U1.6 v28.53,15.92 | v26.58,16.58 26.45,16.58 C6.1 | 23.95,4.01 C8.2 | C7.1 33.2,16.13 arc-45 33.38,16.2 v34.45,16.2 | R8.1 40.17,7.21 arc-45 40.24,7.39 41.56,8.71 | 41.56,8.71 42.47,8.71 arc45 42.65,8.79 43.72,9.85 C9.1 R12.1 45.8,10.43 U3.4 | 41.56,8.71 40.88,9.4 37.58,9.4 v37.12,9.85 39.02,11.76 39.02,13.28 40.17,14.43 R13.1 40.16,16.94 39.43,16.94 38.9,17.47 38.9,20.9 39.91,21.92 42.45,21.92 42.96,21.41 v42.96,19.51 | Q2.E 18.9,20.64 v18.91,20.65
  Top 0.61: 23.95,4.01 v24.67,4.01 25.31,4.01 26.07,4.77 26.07,6.68 C10.1
  Top 0.762: U4.5 21.17,4.05 C5.2
  Top 1.016: C5.2 C8.2
  Bottom 0.254: v81.59,3.3 82.3,4 X2.1 X2.3 X2.5
  Bottom 0.33: v37.12,9.85 35.26,11.83 v34.07,11.83 34.07,15.72 arc-45 34.15,15.9 v34.45,16.2 34.25,16 arc-45 34.07,15.92 v28.53,15.92 27.24,15.92 v26.58,16.58 23.28,13.28 | v42.96,19.51 43.06,19.63 X1.31 | 23.28,13.28 23.28,6.93 24.67,5.54 v24.67,4.01 | 23.28,13.28 23.28,16.97 24.17,17.85 24.17,19.51 23.02,20.65 v18.91,20.65
  Bottom 0.762: X1.31 X1.29 X1.27
AD+  (via drill 0.33)
  Top 0.305: R3.1 19.89,9.54 v19.9,9.52
  Top 0.33: U2.2 14.9,9.47 v15.78,9.47
  Top 0.406: J1.USB_P 12.65,12.5 v12.66,12.5 | v13.32,10.46 13.33,10.48 U2.2
  Bottom 0.33: v15.78,9.47 19.85,9.47 arc90 v19.9,9.52
  Bottom 0.406: v12.66,12.5 13.32,11.83 v13.32,10.46
AD-  (via drill 0.3, 0.33)
  Top 0.254: 16.04,10.52 U2.3
  Top 0.305: R2.1 19.89,13.4 v19.9,13.41 | v16.04,11.12 16.04,10.52
  Top 0.406: J1.USB_M 12.12,10.5 12.86,11.25 15.91,11.25 v16.04,11.12
  Bottom 0.305: v19.9,13.41 16.29,13.41 15.53,12.65 15.53,11.63 v16.04,11.12
CON  (via drill 0.3)
  Top 0.254: U1.15 v24.93,9.88 23.05,9.88 v22.51,9.35 | 41.47,6.3 arc45 LED1.C 41.58,6.3 42.2,6.3 | 42.2,6.3 42.45,6.04 42.45,3.88 42.2,3.63 39.41,3.63 39.02,3.25 39.02,2.61 38.64,2.23 v37.5,2.23 | 42.2,6.3 42.45,6.55 42.45,7.06 42.58,7.19 44.87,7.19 v45.37,6.68 | v23.4,18.11 22.28,18.11 R5.2
  Bottom 0.254: v24.93,9.88 24.93,8.2 27.59,5.54 32.29,5.54 35.6,2.23 v37.5,2.23 | X1.11 45.08,9 45.63,8.46 45.63,6.93 v45.37,6.68 | v22.51,9.35 22.77,9.6 22.77,17.47 v23.4,18.11
D+  (via drill 0.3)
  Top 0.254: R3.2 21.59,9.38 v21.63,9.35 | R4.1 22.64,16.82 22.64,15.95 22.26,15.57 v21.63,15.57
  Top 0.305: U1.14 R3.2
  Bottom 0.254: v21.63,9.35 21.63,9.73 22.26,10.36 22.26,14.93 v21.63,15.57
D-
  Top 0.305: U1.13 22.81,11.17 R2.2
E0_1
  Bottom 0.254: JP1.6 J2.1 69.91,3.3 71.56,3.3 72.2,3.94 73.85,3.94 74.36,4.44 78.42,4.44 78.55,4.57 78.55,6.22 79.83,7.5 X2.8
E0_4  (via drill 0.3, 0.33)
  Top 0.254: v89.34,17.02 89.34,16.13 88.07,14.86 v76.51,14.86 | v60.51,16.38 70.55,16.38 71.56,15.37 v71.56,14.86 | v57.59,8 JP3.2
  Bottom 0.254: X2.29 85.24,18.03 86.93,18.03 87.94,17.02 v89.34,17.02 | v76.51,14.86 v71.56,14.86 | v60.51,16.38 60.51,9.27 59.24,8 v57.59,8
E0_5  (via drill 0.3, 0.33)
  Top 0.254: JP3.3 56.45,10.54 57.59,11.68 v57.59,12.95 | v57.59,18.67 57.85,18.92 76.13,18.92 79.69,15.37 86.93,15.37 88.58,17.02 v88.58,17.91
  Bottom 0.254: X2.31 87.48,19 v88.58,17.91 | v57.59,18.67 v57.59,12.95
E0_8
  Bottom 0.254: X2.30 80.72,21.07 79.94,21.84 JP2.9
E0_9
  Bottom 0.254: JP2.8 74.61,20.19 75.24,19.56 78.67,19.56 79.56,18.67 79.56,17.78 79.84,17.5 X2.28
E0_10
  Bottom 0.254: JP2.7 72.07,19.94 72.45,19.56 74.48,19.56 74.99,19.05 78.42,19.05 79.05,18.41 79.05,16.89 79.44,16.5 X2.26
E0_11
  Bottom 0.254: JP2.6 J6.1 70.04,19.68 71.56,19.68 72.2,19.05 74.23,19.05 74.74,18.54 78.17,18.54 78.55,18.16 78.55,16.51 79.56,15.49 X2.24
E0_12
  Bottom 0.254: X2.22 79.53,14.5 78.04,16 78.04,17.78 77.78,18.03 74.48,18.03 73.97,18.54 71.94,18.54 71.56,18.92 67.75,18.92 66.99,19.68 J7.1 JP2.5
E0_13
  Bottom 0.254: JP2.4 J5.1 64.45,20.06 62.8,18.41 62.8,16.76 63.18,16.38 70.42,16.38 72.07,18.03 73.72,18.03 74.23,17.52 77.4,17.52 77.53,17.4 77.53,15.75 79.77,13.5 X2.20
E0_14
  Bottom 0.254: 80.65,12.57 X2.18 77.34,12.5 76.9,12.95 64.07,12.95 62.29,14.73 62.29,21.46 JP2.3
E0_15
  Bottom 0.254: X2.16 77.58,11.5 76.64,12.44 63.69,12.44 61.78,14.35 61.78,18.41 59.37,20.83 JP2.2
E0_16
  Bottom 0.254: X2.14 80.68,10.54 79.56,10.54 79.05,10.03 63.56,10.03 61.91,8.38 JP1.3
E0_18
  Bottom 0.254: X2.6 79.72,6.5 79.05,5.84 79.05,4.32 78.67,3.94 74.61,3.94 74.1,3.43 72.45,3.43 72.07,3.05 JP1.7
E0_19
  Bottom 0.254: X2.4 79.73,5.5 79.56,5.33 79.56,4.06 78.93,3.43 74.99,3.43 74.61,3.05 JP1.8
E0_22  (via drill 0.3)
  Top 0.254: 83.13,9.64 R17.2 | 83.13,9.64 83.15,9.65 | 83.13,9.64 83.35,9.42 v83.35,9.37
  Bottom 0.254: X2.25 83.76,16 82.99,15.24 82.99,9.73 v83.35,9.37
E0_23
  Bottom 0.254: X2.12 63.8,9.5 62.42,8.13 62.42,4.82 62.93,4.32 63.94,4.32 64.45,3.81 J4.1 | J4.1 JP1.4 | 64.45,3.3 J4.1
E1_15
  Bottom 0.254: JP1.5 J3.1 66.99,3.43 67.75,4.19 71.69,4.19 71.94,4.44 73.59,4.44 74.1,4.95 77.78,4.95 78.04,5.21 78.04,6.48 80.07,8.5 X2.10
E1_19
  Bottom 0.254: X2.2 80.72,1.91 79.94,1.14 JP1.9
EENA  (via drill 0.3)
  Top 0.254: v89.72,13.46 89.72,6.09 88.58,4.95 87.56,4.95 86.93,4.32 R14.1
  Bottom 0.254: X2.23 88.18,15 v89.72,13.46
ELED  (via drill 0.3)
  Top 0.254: R18.1 82.34,18.29 81.59,18.29 81.09,17.78 81.09,16.64 81.85,15.87 85.53,15.87 86.29,16.64 v86.67,16.64
  Bottom 0.254: X2.27 86.31,17 v86.67,16.64
ENA  (via drill 0.3)
  Top 0.254: U1.3 v30.46,16.81 | v41.82,7.69 48.3,7.69 49.06,6.93 R10.1 | v41.06,14.76 41.18,14.63 v41.18,13.28
  Bottom 0.254: v30.46,16.81 30.87,17.22 35.21,17.22 36.99,19 36.99,19.76 37.5,20.27 40.04,20.27 41.18,19.12 41.18,16.71 41.77,16.13 41.77,15.19 41.34,14.76 v41.06,14.76 | 41.44,8.08 v41.82,7.69 | X1.9 42.13,8 v41.82,7.69 | v41.82,7.69 41.18,8.33 v41.18,13.28
ERST  (via drill 0.3)
  Top 0.254: v86.8,22.35 R16.1
  Bottom 0.254: v86.8,22.35 88.45,22.35 90.87,19.94 90.87,12.95 88.71,10.79 85.43,10.79 arc-90 X2.15
GND  (via drill 0.3)  (1 unrouted)
  Top 0.254: C7.2 34.3,15.06 35.39,16.15 | BOOT.2 BOOT.1 | RESET.2 RESET.1 | v87.08,11.58 84.03,11.58 Q3.E
  Top 0.33: 35.39,16.15 v35.34,16.2
  Bottom 0.254: v87.08,11.58 87.31,11.56
  other vias: 29.12,11.12 29.88,11.89 29.88,11.12 29.12,11.89 24.8,21.03 48.55,21.03 32.8,14.93 39.89,2.49 42.2,9.6 47.79,7.06 49.31,21.03 48.55,20.27 49.31,20.27 49.31,2.74 49.31,1.98 48.55,2.74 48.55,1.98 49.31,13.66 49.31,9.09 48.55,13.66 48.55,14.43 49.31,14.43 48.55,9.09 48.55,8.33 49.31,8.33 19.85,6.93 17.69,20.65 16.93,20.65 26.2,14.93 13.24,17.35 14.01,17.35 14.01,16.58 13.24,16.58 13.24,15.82 14.01,15.82 22.26,6.93 22.26,7.69 22.26,8.46 13.24,7.19 14.01,7.19 13.24,6.42 14.01,6.42 14.01,5.66 13.24,5.66 25.56,21.03 25.56,20.27 24.8,20.27 24.8,2.74 25.56,2.74 25.56,1.98 24.8,1.98 45.02,14.83 54.65,21.03 91.6,11.89 87.79,21.54 71.54,11.63 83.73,14.17 87.79,8.96 91.6,6.42 81.44,20.27 79.03,20.27 59.09,16.2 57.31,10.23 60.61,3.38 79.54,2.11 58.96,7.31 59.73,7.31 59.73,6.55 58.96,6.55 92.36,11.89 92.36,11.12 91.6,11.12 91.6,5.66 92.36,5.66 92.36,6.42 91.6,17.47 91.6,16.71 92.36,16.71 92.36,17.47 76.49,16.33 76.36,11.5 80.3,22.55 63.28,6.81 62.01,9.6 62.9,3.38 77.38,14.04 78.27,8.08
  pour Top: -0.73,18.36 -0.73,4.77 9.81,4.65 11.34,4.65 11.34,-0.81 53.76,-0.94 94.42,-0.76 94.42,23.37 53.53,23.37 52.77,29.67 52.74,29.67 42.96,29.54 39.79,23.95 11.34,23.7 11.34,18.36
  pour Bottom: -0.73,4.77 11.34,4.65 11.34,-0.81 53.76,-0.94 94.42,-0.76 94.42,23.37 53.53,23.37 52.77,29.67 52.74,29.67 42.96,29.54 39.79,23.95 11.34,23.7 11.34,18.36 -0.73,18.36
LED  (via drill 0.3, 0.33)
  Top 0.254: U1.16 25.94,8.94 v25.94,8.33 | v38.14,2.87 38.14,6.3 v40.55,8.71 | v40.45,10.08 40.17,10.36 R9.1 | v46.77,15.06 46.16,15.06 45.73,15.49 43.49,15.49 43.06,15.06 v42.43,15.06
  Bottom 0.254: v38.14,2.87 35.85,2.87 32.67,6.17 27.98,6.17 25.94,8.2 v25.94,8.33 | v40.55,8.71 40.55,9.98 v40.45,10.08 40.45,13.56 40.93,14.04 41.95,14.04 42.43,14.53 v42.43,15.06 | X1.5 43.9,5.79 45.5,5.79 46.14,6.42 46.14,11.5 47.03,12.39 47.03,13.66 46.77,13.92 v46.77,15.06
N$1
  Top 0.254: 20.14,16.84 Q2.C
  Top 0.762: R4.2 20.14,16.84
N$2
  Top 0.254: 20.86,19.39 Q2.B | R6.2 17.43,17.23 R7.1
  Top 0.406: Q2.B 20.8,20.97 20.1,21.66 16.67,21.66 16.04,21.03 16.04,18.74 16.67,18.11 17.42,18.11 R7.1
  Top 0.635: R5.1 20.86,19.39
N$3
  Top 0.254: Q3.C 82.31,13.21 74.48,13.21 73.34,12.06 73.34,10.54 74.36,9.52 SG1.- 73.4,7.56 73.34,7.49
N$4
  Top 0.254: R18.2 83.78,17 arc-90 L.A
N$5
  Top 0.254: BOOT.4 BOOT.3 88.13,2.27 R14.2
N$6
  Top 0.254: RESET.4 RESET.3 88,19.03 R16.2
N$7
  Top 0.254: Q3.B 81.71,10.66 R17.1
N$8  (via drill 0.3)
  Top 0.254: 84.02,6.48 CHG.C v83.38,6.46 v83.37,6.48 | U5.1 62.89,9.65 70.67,9.65 v71.56,8.76 | v76.39,8.76 76.39,9.4 75.88,9.9 74.74,9.9 73.85,10.79 73.85,11.81 74.74,12.7 80.96,12.7 81.7,11.96 83.12,11.96 83.6,12.44 v83.63,12.44
  Bottom 0.254: v83.37,6.48 84.13,7.24 84.13,11.94 v83.63,12.44 | v76.39,8.76 76.13,9.02 71.82,9.02 v71.56,8.76
N$9
  Top 0.254: R15.1 84.01,4.94 CHG.A
N$10
  Top 0.254: U5.5 59.86,10.08 R19.2
N$11  (via drill 0.3)
  Top 0.457: U5.3 63.25,12.63 D1.A 65.73,11.68 67,10.41 69.53,10.41 69.91,10.79 v71.56,10.79 | J8.2 84.36,8.13 80.45,8.13 77.91,10.67 v75.37,10.67
  Bottom 0.457: v71.56,10.79 71.69,10.67 v75.37,10.67
N$12
  Top 0.254: R9.2 41.21,12.03 LED2.A
N$14
  Top 0.254: S1.4 49.06,4.66 R10.2
  Top 0.762: S1.3 S1.4
N$20
  Top 0.254: S2.4 49.06,16.85 R11.2
  Top 0.762: S2.3 S2.4
N$22
  Top 0.254: R8.2 41.44,4.76 LED1.A
N$23
  Top 0.254: R13.2 41.21,18.25 LED3.A
RST  (via drill 0.3)
  Top 0.254: U1.2 31.18,14.83 31.18,16.61 32.04,17.47 35.72,17.47 v37.75,19.51 | U3.2 47.76,11.38 46.39,11.38 45.74,12.03 R12.2 v45.5,14.04 42.33,14.04 41.69,14.68 41.69,16.6 LED3.C 41.56,16.2 v41.06,15.7
  Bottom 0.254: v37.75,19.51 40.04,19.51 40.55,19 40.55,16.2 v41.06,15.7 | X1.17 44.73,12 45.12,12.39 45.12,13.66 v45.5,14.04
RSTE  (via drill 0.3)
  Top 0.254: R11.1 v49.06,19.12 | U3.3 46.61,12.81 v46.39,13.03
  Bottom 0.254: v46.39,13.03 46.14,13.28 46.14,18.49 46.77,19.12 v49.06,19.12
USBON
  Top 0.254: U1.9 24.93,13.79 24.55,14.17 19.34,14.17 18.7,13.54 R1.2
VBUS  (via drill 0.3, 0.33)  (1 unrouted)
  Top 0.254: 8.67,8.08 J1.5V | R15.2 82.38,7.42 | R19.1 61.16,6.71 62.29,5.59 J4.2
  Top 0.305: v45.4,18.79 43.75,20.45 43.75,21.59 42.86,22.48 34.48,22.48 v33.97,21.97
  Top 0.406: L1.1 17.26,12.38 U2.4 15.99,13.58 15.53,14.04 v14.89,14.04 | v14.13,8.08 8.67,8.08
  Top 0.457: 71.69,6.48 72.96,5.21 76.9,5.21 79.11,7.42 82.38,7.42 v86.95,7.42 | JP3.5 56.96,15.62 | 56.96,15.62 58.99,17.65 J5.2 | 72.45,16 73.91,16 arc-90 SG1.+ | D1.C 70.42,11.68 72.45,13.71 | U5.4 59.21,14 57.59,15.62 56.96,15.62
  Top 0.61: J6.2 70.8,17.65 72.45,16 72.45,13.71 72.45,7.24 71.69,6.48 70.8,5.59 69.91,5.59 J2.2
  Bottom 0.305: 14.92,14.07 14.92,20.45 15.81,21.33 23.05,21.33 23.68,21.97 v33.97,21.97 | v45.4,18.79 45.4,16.13 44.76,15.49 43.69,15.49
  Bottom 0.406: v14.13,8.08 14.89,8.84 v14.89,14.04 14.92,14.07 | X1.25 43.69,15.49 X1.23
  Bottom 0.457: 85.7,7.49 85.83,7.36 v86.95,7.42
  Bottom 0.61: 69.66,5.59 J2.2 | 85.7,7.49 arc90 X2.7 X2.9
  Bottom 0.762: J4.2 J3.2 69.66,5.59 | J5.2 J7.2 J6.2
VCC
  Top 0.254: U4.3 19.09,6.06
  Top 0.406: U4.3 18.9,7.25 19.47,7.82 20.22,7.82 20.8,7.25 U4.1 | R1.1 17.26,10.73 L1.2 17.26,5.93 C3.2
  Top 0.762: U4.3 17.56,5.87 C3.2
  Top 1.016: C4.2 C3.2
XIN
  Top 0.254: C2.1 31.69,20 Q1.3 30.68,20.01 30.01,20.01 29.5,19.51 29.5,17.6 29.78,17.32 29.78,14.83 U1.4
XOUT
  Top 0.254: C1.1 27.34,18.1 Q1.1 28.4,17.76 29.22,16.94 29.22,14.78 U1.5

### Text on the board
bNames: V0.2